# EAGLE design Pool Controller (EAGLE 7.7.0)
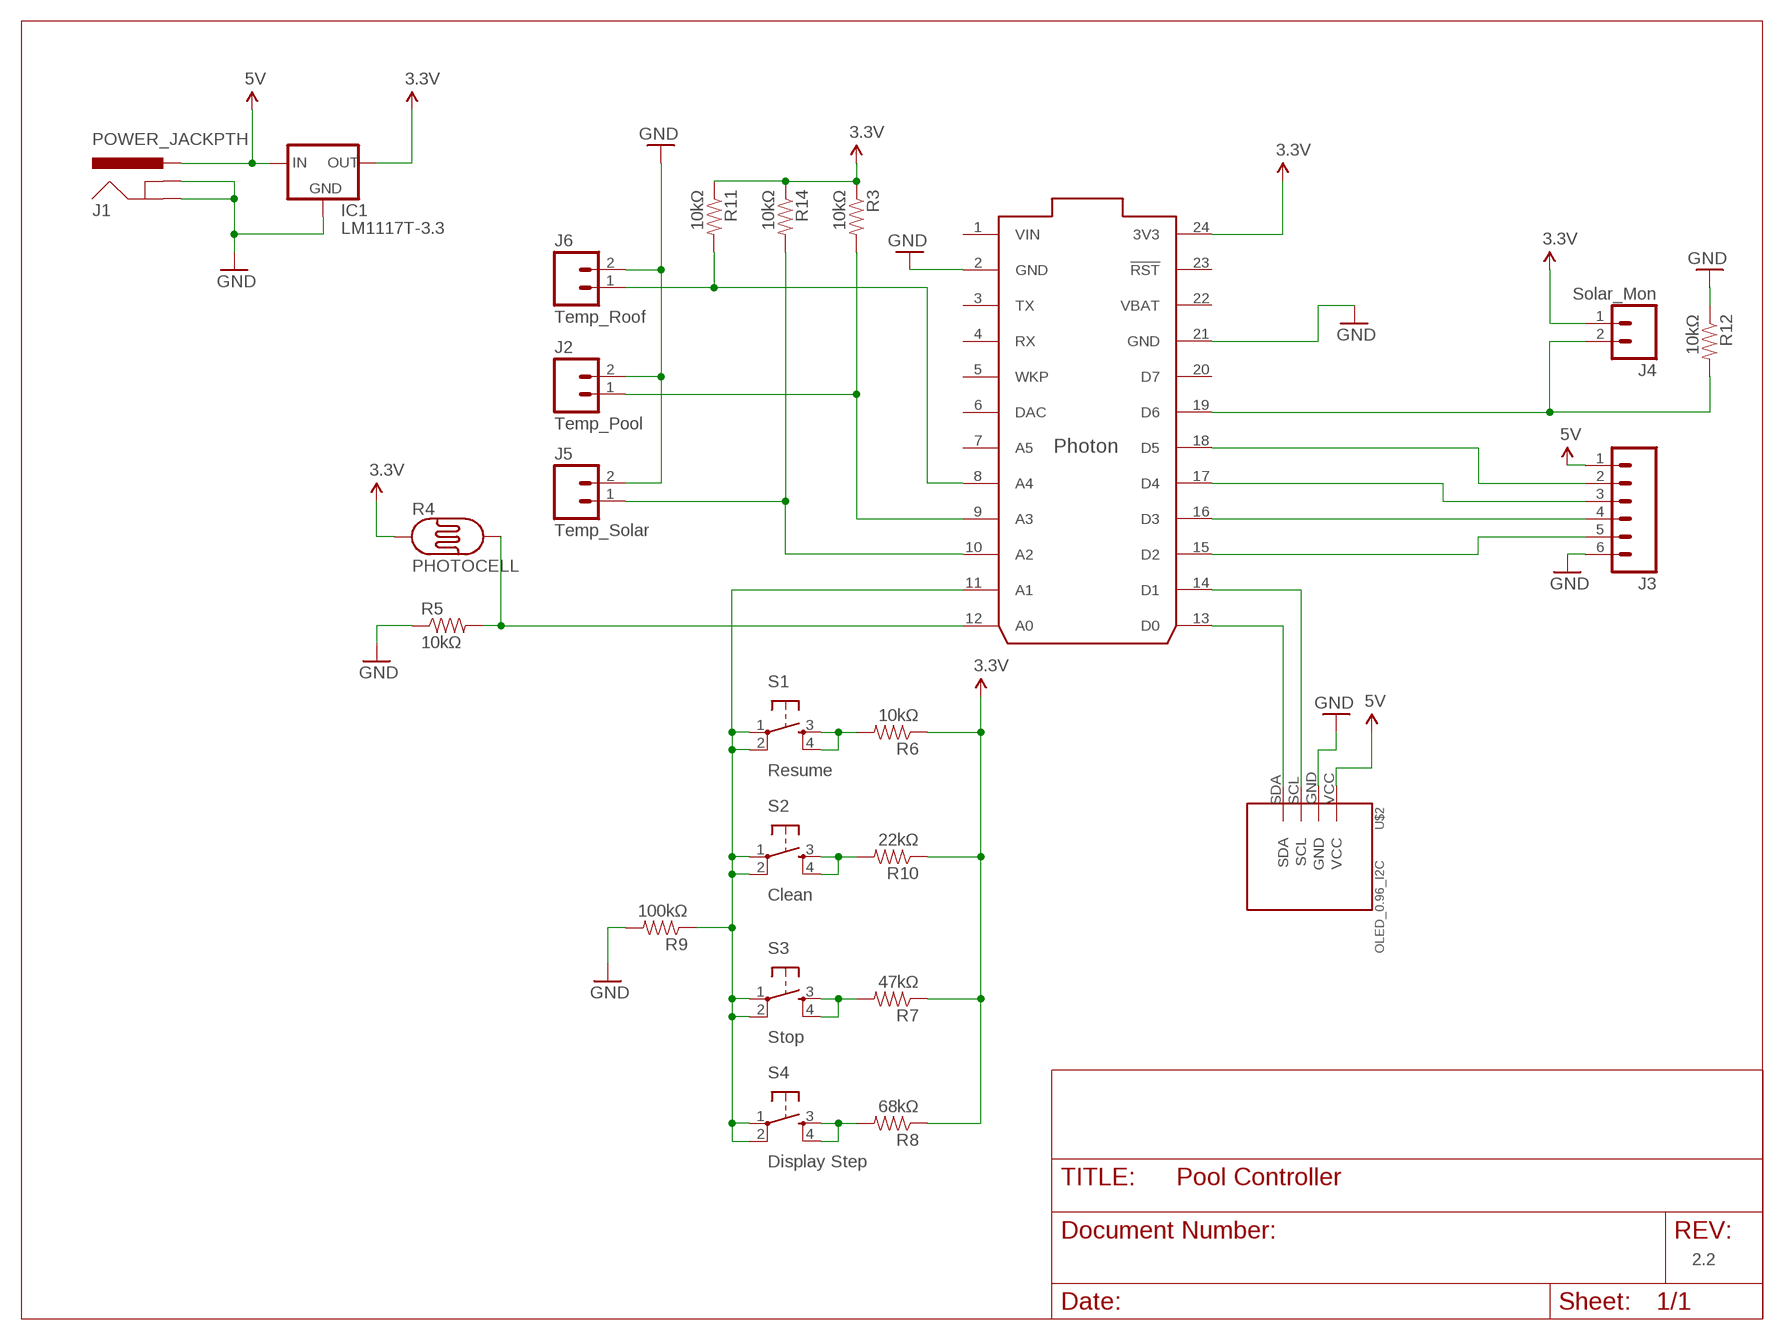
[diagram p0: schematic, sheet 1]

## Parts
IC1  LM1117T-3.3  LM1117T-3.3-V  [TO220V]
J1  POWER_JACKPTH  [POWER_JACK_PTH]
J2  Temp_Pool  M025MM  [SCREWTERMINAL-5MM-2]
J3  M06SILK_FEMALE_PTH  [1X06]
J4  Solar_Mon  M025MM  [SCREWTERMINAL-5MM-2]
J5  Temp_Solar  M025MM  [SCREWTERMINAL-5MM-2]
J6  Temp_Roof  M025MM  [SCREWTERMINAL-5MM-2]
PHOTON  PHOTON_WITH_HEADERS  [PHOTON]
R3  10kΩ  RESISTORAXIAL-0.3  [AXIAL-0.3]
R4  PHOTOCELL  PHOTOCELLPTH  [PHOTOCELL]
R5  10kΩ  RESISTORAXIAL-0.3  [AXIAL-0.3]
R6  10kΩ  RESISTORAXIAL-0.3  [AXIAL-0.3]
R7  47kΩ  RESISTORAXIAL-0.3  [AXIAL-0.3]
R8  68kΩ  RESISTORAXIAL-0.3  [AXIAL-0.3]
R9  100kΩ  RESISTORAXIAL-0.3  [AXIAL-0.3]
R10  22kΩ  RESISTORAXIAL-0.3  [AXIAL-0.3]
R11  10kΩ  RESISTORAXIAL-0.3  [AXIAL-0.3]
R12  10kΩ  RESISTORAXIAL-0.3  [AXIAL-0.3]
R14  10kΩ  RESISTORAXIAL-0.3  [AXIAL-0.3]
S1  Resume  TAC_SWITCHPTH  [TACTILE-PTH]
S2  Clean  TAC_SWITCHPTH  [TACTILE-PTH]
S3  Stop  TAC_SWITCHPTH  [TACTILE-PTH]
S4  Display Step  TAC_SWITCHPTH  [TACTILE-PTH]
U$2  OLED_0.96_I2C  [OLED_0.96_I2C]

## Nets
3.3V: IC1.2(OUT) J4.1 PHOTON.24(3V3) R3.P$1 R4.1 R6.P$1 R7.P$1 R8.P$1 R10.P$1 R11.P$1 R14.P$1
5V: IC1.3(IN) J1.PWR J3.1 U$2.VCC
GND: IC1.1(GND) J1.GND J1.GNDBREAK J2.2 J3.6 J5.2 J6.2 PHOTON.2(GND) PHOTON.21(GND) R5.P$1 R9.P$2 R12.P$1 U$2.GND
N$1: J3.5 PHOTON.15(D2)
N$2: J3.4 PHOTON.16(D3)
N$3: PHOTON.13(D0) U$2.SDA
N$4: PHOTON.14(D1) U$2.SCL
N$5: PHOTON.12(A0) R4.2 R5.P$2
N$6: J3.3 PHOTON.17(D4)
N$7: J3.2 PHOTON.18(D5)
N$8: R7.P$2 S3.3 S3.4
N$9: J4.2 PHOTON.19(D6) R12.P$2
N$10: R10.P$2 S2.3 S2.4
N$11: J5.1 PHOTON.10(A2) R14.P$2
N$12: J2.1 PHOTON.9(A3) R3.P$2
N$13: R8.P$2 S4.3 S4.4
N$14: PHOTON.11(A1) R9.P$1 S1.1 S1.2 S2.1 S2.2 S3.1 S3.2 S4.1 S4.2
N$15: R6.P$2 S1.3 S1.4
N$17: J6.1 PHOTON.8(A4) R11.P$2
Unconnected: PHOTON.3(TX) PHOTON.4(RX) PHOTON.5(WKP) PHOTON.6(DAC) PHOTON.7(A5) PHOTON.20(D7) PHOTON.23(!RST)

## Notes on the sheet
- 2.2

## Power pins joined to a net without a drawn wire
VBAT: PHOTON.22(VBAT)
VIN: PHOTON.1(VIN)

## Library data of the parts
IC1 = lm1117:LM1117T-*
J1 = SparkFun-Connectors:POWER_JACK: Power Jack This is the standard 5.5mm barrel jack for power. The PTH is the most common, proven, reliable, footprint. The Slot footprint only works if the mill layer is transmitted to the PCB fab house so be warned. Mating wall wart : TOL-00298 (and others); PROD_ID: CONN-08197
J2 J4-J6 = SparkFun-Connectors:M02: Standard 2-pin 0.1" header. Use with - straight break away headers ( PRT-00116) - right angle break away headers (PRT-00553) - swiss pins (PRT-00743) - machine pins (PRT-00117) - female headers (PRT-00115) Molex polarized connector foot print use with: PRT-08233 with associated crimp pins and housings. 2.54_SCREWTERM for use with PRT-10571. 3.5mm Screw Terminal footprints for PRT-08084 5mm Screw Terminal footprints for use with PRT-08432; STOREFRONT_ID: PRT-08432
J3 = SparkFun-Connectors:M06: Header 6 Standard 6-pin 0.1" header. Use with straight break away headers (SKU : PRT-00116), right angle break away headers (PRT-00553), swiss pins (PRT-00743), machine pins (PRT-00117), and female headers (PRT-00115). Molex polarized connector foot print use with SKU : PRT-08094 with associated crimp pins and housings. NOTES ON THE VARIANTS LOCK and LOCK_LONGPADS... This footprint was designed to help hold the alignment of a through-hole component (i.e. 6-pin header) while soldering it into place. You may notice that each hole has been shifted either up or down by 0.005 of an inch from it's more standard position (which is a perfectly straight line). This slight alteration caused the pins (the squares in the middle) to touch the edges of the holes. Because they are alternating, it causes a "brace" to hold the component in place. 0.005 has proven to be the perfect amount of "off-center" position when using our standard breakaway headers. Although looks a little odd when you look at the bare footprint, once you have a header in there, the alteration is very hard to notice. Also,if you push a header all the way into place, it is covered up entirely on the bottom side. This idea of altering the position of holes to aid alignment will be further integrated into the Sparkfun Library for other footprints. It can help hold any component with 3 or more connection pins.; PROD_ID: CONN-08437
PHOTON = Spark:PHOTON
R3 R5-R12 R14 = SparkFun-Passives:RESISTOR: Resistor Basic schematic elements and footprints for 0603, 1206, and PTH resistors.
R4 = SparkFun-Sensors:PHOTOCELL: CdS photoresistor. This is a low cost way to detect light levels. Resistance decreases with more incoming light. SparkFun SKU: SEN-09088
S1-S4 = SparkFun-Retired:TAC_SWITCH: Momentary Switch Button commonly used for reset or general input. Spark Fun Electronics SKU : COM-00097 SMT- SWCH-08247
U$2 = tft_1.8_1.44_oled_0.96:OLED_0.96_I2C

## Board
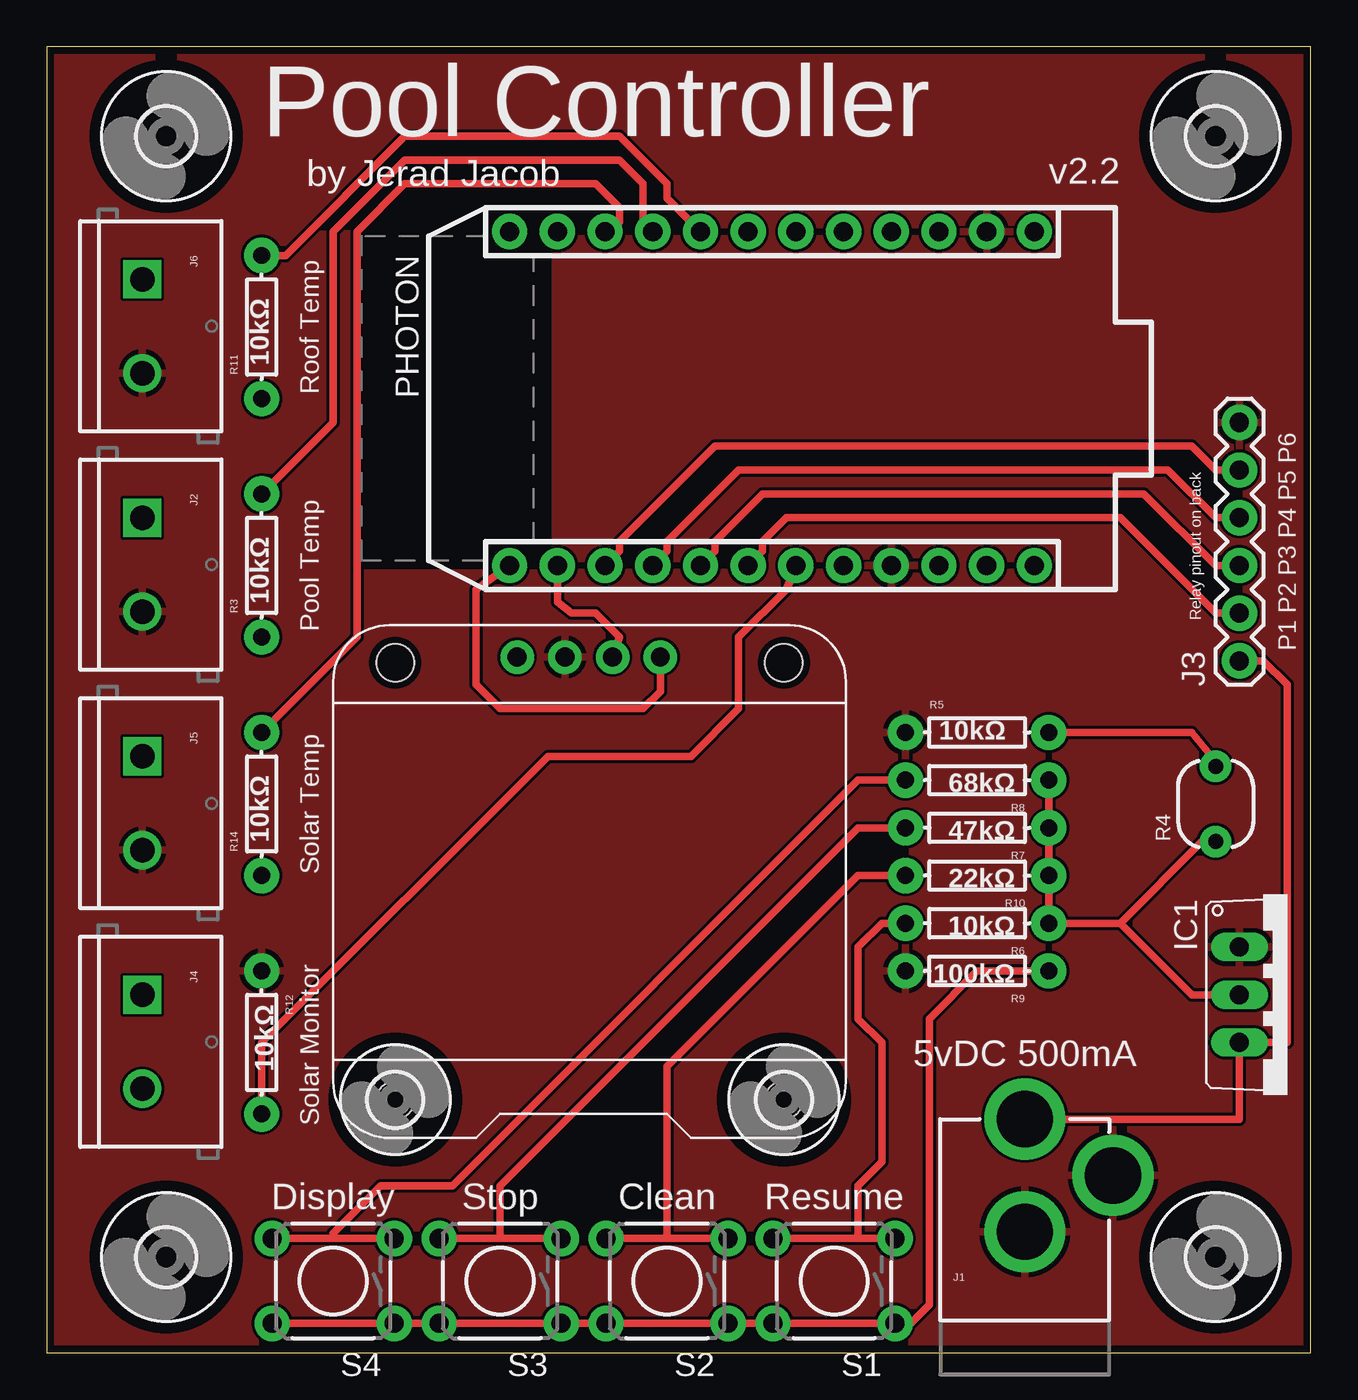
[diagram p1: board, top side]
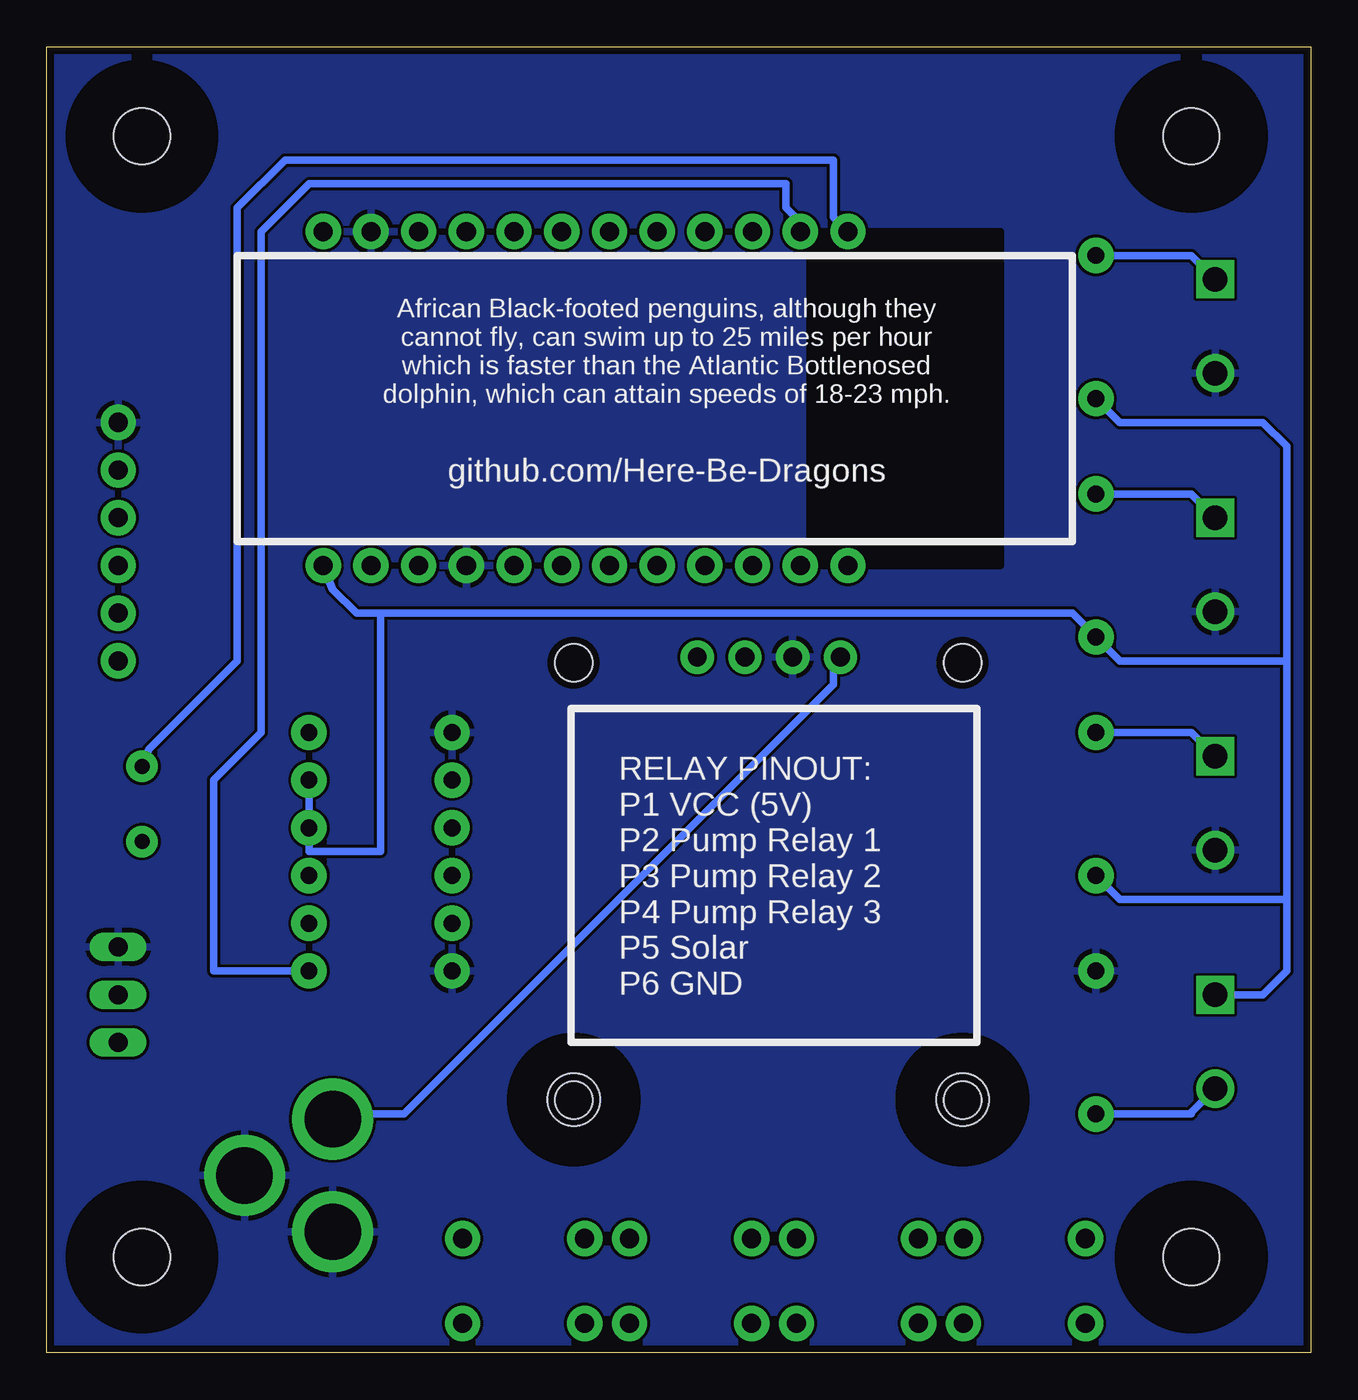
[diagram p2: board, bottom side, seen from below]

Size 67.29 x 69.52 mm. Coordinates in mm from the lower left corner, seen from the top.
Outline: 0,0 67.29,0 67.29,69.52 0,69.52 0,0
Copper layers (1*16): Top 0.0356mm / dielectric 1.5011mm / Bottom 0.0356mm
Design rules "oshpark-2layer": minimum track width 6mil, minimum drill 13mil, track to track 6mil, track to pad 6mil, pad to pad 6mil, via to via 6mil, smd to smd 6mil, copper to edge 15mil, drill to drill 6mil, minimum pad ring 7mil, minimum via ring 7mil, stop-mask expansion 2.5mil, vias tented up to drill 0mil, thermal gap 10mil

### Footprints (pad centres in the part's own frame; a part is rotated, then mirrored left to right if it is on the bottom)
TO220V = drill 1.016 long: 1 -2.54,-2.54; 2 0,-2.54; 3 2.54,-2.54
POWER_JACK_PTH = drill 2.997 pad 4.318: GND 0,7.7; GNDBREAK 4.7,10.7; PWR 0,13.7
SCREWTERMINAL-5MM-2 = drill 1.3 pad 2.032 square: 1 0,0 | drill 1.3 pad 2.032: 2 5,0
1X06 = drill 1.016 pad 1.88: 1 0,0; 2 2.54,0; 3 5.08,0; 4 7.62,0; 5 10.16,0; 6 12.7,0
PHOTON = drill 1.016 pad 1.88: 1 1.27,32.258; 2 1.27,29.718; 3 1.27,27.178; 4 1.27,24.638; 5 1.27,22.098; 6 1.27,19.558; 7 1.27,17.018; 8 1.27,14.478; 9 1.27,11.938; 10 1.27,9.398; 11 1.27,6.858; 12 1.27,4.318; 13 19.05,4.318; 14 19.05,6.858; 15 19.05,9.398; 16 19.05,11.938; 17 19.05,14.478; 18 19.05,17.018; 19 19.05,19.558; 20 19.05,22.098; 21 19.05,24.638; 22 19.05,27.178; 23 19.05,29.718; 24 19.05,32.258
AXIAL-0.3 = drill 0.9 pad 1.88: P$1 -3.81,0; P$2 3.81,0
PHOTOCELL = drill 0.8 pad 1.676: 1 -2,0; 2 2,0
TACTILE-PTH = drill 1.016 pad 1.88: 1 -3.251,2.261; 2 3.251,2.261; 3 -3.251,-2.261; 4 3.251,-2.261
2,8 = hole 2.8: 0,0
OLED_0.96_I2C = drill 1 pad 1.778: GND -1.63,11.63; SCL 0.91,11.63; SDA 3.45,11.63; VCC -4.17,11.63 | hole 2: -10.67,-11.97; 10.03,-11.97; 10.03,11.33; -10.67,11.33
3,0 = hole 3: 0,0

### Placement (x,y rotation side)
IC1  66.04,19.05 270 top
J1  52.07,-1.27 0 top
J2  5.08,44.45 270 top
J3  63.5,36.83 90 top
J4  5.08,19.05 270 top
J5  5.08,31.75 270 top
J6  5.08,57.15 270 top
PHOTON  20.32,60.96 270 top
R3  11.43,41.91 90 top
R4  62.23,29.21 90 top
R5  49.53,33.02 0 top
R6  49.53,22.86 180 top
R7  49.53,27.94 180 top
R8  49.53,30.48 180 top
R9  49.53,20.32 180 top
R10  49.53,25.4 180 top
R11  11.43,54.61 90 top
R12  11.43,16.51 270 top
R14  11.43,29.21 90 top
S1  41.91,3.81 180 top
S2  33.02,3.81 180 top
S3  24.13,3.81 180 top
S4  15.24,3.81 180 top
U$1  [2,8]  18.54,13.46 0 top
U$2  29.21,25.4 0 top
U$3  [3,0]  6.35,64.77 0 top
U$4  [3,0]  6.35,5.08 0 top
U$5  [3,0]  62.23,5.08 0 top
U$6  [3,0]  62.23,64.77 0 top
U$7  [2,8]  39.24,13.46 0 top

### Tracks (layer width: path | path; a pad name or v marks a point on that pad's centre or on a via)
3.3V
  Top 0.406: R8.P$1 R7.P$1 R10.P$1 R6.P$1 57.15,22.86 | IC1.2 60.96,19.05 57.15,22.86 | R4.1 61.5,27.21 57.15,22.86
  Bottom 0.406: R8.P$1 53.34,26.67 49.53,26.67 49.53,39.37 | 1.27,36.83 10.16,36.83 R3.P$1 12.7,39.37 49.53,39.37 | 1.27,36.83 1.27,24.13 | 1.27,24.13 10.16,24.13 R14.P$1 | J4.1 2.54,19.05 1.27,20.32 1.27,24.13 | R11.P$1 10.16,49.53 2.54,49.53 1.27,48.26 1.27,36.83 | PHOTON.24 52.07,40.64 50.8,39.37 49.53,39.37
5V
  Top 0.406: J1.PWR 63.5,12.43 IC1.3 66.04,16.51 66.04,35.56 64.77,36.83 J3.1
  Bottom 0.406: J1.PWR 50.8,12.7 48.26,12.7 25.4,35.56 25.4,36.83 U$2.VCC
GND
  cutout Bottom: 16.51,59.69 16.51,41.91 26.67,41.91 26.67,59.69
  pour Bottom: 0,69.85 0,0 67.31,0 67.31,69.85
  pour Top: 0,69.85 0,0 67.31,0 67.31,69.85
  cutout Top: 16.51,59.69 16.51,41.91 26.67,41.91 26.67,59.69
N$1
  Top 0.406: J3.5 62.23,46.99 60.96,48.26 35.56,48.26 30.48,43.18 30.48,42.67 PHOTON.15
N$2
  Top 0.406: J3.4 62.23,44.45 59.69,46.99 36.83,46.99 33.02,43.18 33.02,42.67 PHOTON.16
N$3
  Top 0.406: U$2.SDA 32.66,35.2 31.75,34.29 24.13,34.29 22.86,35.56 22.86,40.64 PHOTON.13
N$4
  Top 0.406: PHOTON.14 27.18,39.97 27.94,39.37 29.21,39.37 30.48,38.1 U$2.SCL
N$5
  Top 0.406: R5.P$2 60.96,33.02 62.04,31.67 R4.2
  Bottom 0.406: PHOTON.12 25.4,60.45 25.4,63.5 54.61,63.5 57.15,60.96 57.15,36.83 61.87,32.12 R4.2
N$6
  Top 0.406: J3.3 62.23,41.91 58.42,45.72 38.1,45.72 35.56,43.18 35.56,42.67 PHOTON.17
N$7
  Top 0.406: J3.2 62.23,39.37 57.15,44.45 39.37,44.45 38.1,43.18 38.1,42.67 PHOTON.18
N$8
  Top 0.406: S3.4 24.13,6.07 | 24.13,6.07 S3.3 | R7.P$2 43.18,27.94 24.13,8.89 24.13,6.07
N$9
  Top 0.406: R12.P$2 11.43,16.51 26.67,31.75 34.29,31.75 36.83,34.29 36.83,38.1 39.37,40.64 PHOTON.19
  Bottom 0.406: R12.P$2 6.35,12.7 6.35,12.78 J4.2
N$10
  Top 0.406: S2.3 33.02,6.07 | 33.02,6.07 30.76,6.07 | R10.P$2 43.18,25.4 33.02,15.24 33.02,6.07 | 30.48,6.35 arc90 30.76,6.07 | 30.76,6.07 S2.4
N$11
  Top 0.406: R14.P$2 16.51,38.1 16.51,59.69 19.05,62.23 29.21,62.23 30.48,60.96 30.48,60.2 PHOTON.10
  Bottom 0.406: R14.P$2 6.35,33.02 J5.1
N$12
  Top 0.406: R3.P$2 15.24,49.53 15.24,59.69 19.05,63.5 30.48,63.5 31.75,62.23 31.75,60.2 PHOTON.9
  Bottom 0.406: R3.P$2 6.35,45.72 J2.1
N$13
  Top 0.406: R8.P$2 43.18,30.48 21.59,8.89 17.78,8.87 15.24,6.35 15.24,6.07 | 12.7,6.35 12.27,6.35 S4.4 15.24,6.07 | S4.3 15.24,6.07
N$14
  Top 0.406: S4.2 S4.1 S3.2 S3.1 S2.2 S2.1 S1.2 S1.1 46,1.55 46.99,2.54 46.99,17.78 49.53,20.32 R9.P$1
  Bottom 0.406: R9.P$1 58.42,20.32 58.42,30.48 55.88,33.02 55.88,59.69 53.34,62.23 27.94,62.23 27.94,60.96 27.18,60.2 PHOTON.11
N$15
  Top 0.406: S1.4 43.18,6.07 | 43.18,6.07 S1.3 | R6.P$2 44.45,22.86 43.18,21.59 43.18,17.78 44.45,16.51 44.45,10.16 43.18,8.89 43.18,6.07
N$17
  Top 0.406: PHOTON.8 33.02,61.47 33.02,62.23 30.48,64.77 19.05,64.77 12.7,58.42 R11.P$2
  Bottom 0.406: R11.P$2 6.35,58.42 J6.1

### Text on the board
tPlace: Pool Controller | by Jerad Jacob | v2.2 | Roof Temp | P1 P2 P3 P4 P5 P6 | Pool Temp | Relay pinout on back | Solar Temp | Solar Monitor | 5vDC 500mA | Display | Stop | Clean | Resume
bPlace: African Black-footed penguins, although they / cannot fly, can swim up to 25 miles per hour / which is faster than the Atlantic Bottlenosed / dolphin, which can attain speeds of 18-23 mph. | github.com/Here-Be-Dragons | RELAY PINOUT: / P1 VCC (5V) / P2 Pump Relay 1 / P3 Pump Relay 2 / P4 Pump Relay 3 / P5 Solar / P6 GND